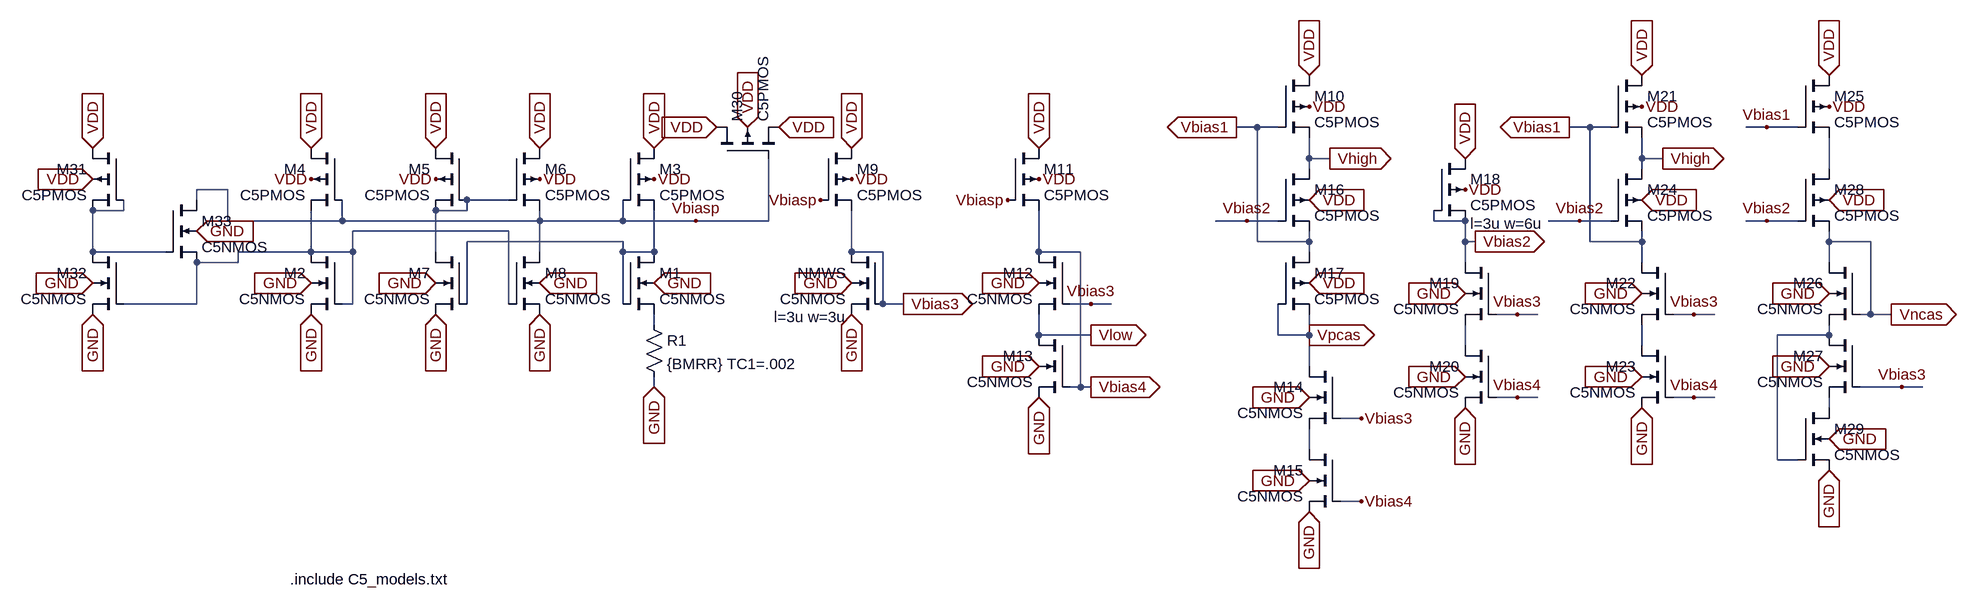
[diagram p0: schematic BMRCASC.asc]
BMRCASC.asc, the LTspice schematic file:
Version 4
SHEET 1 2832 776
WIRE 1680 -80 1648 -80
WIRE 1712 -80 1680 -80
WIRE 2192 -80 2160 -80
WIRE 2224 -80 2192 -80
WIRE 2464 -80 2432 -80
WIRE 2512 -80 2464 -80
WIRE 1760 -32 1760 -64
WIRE 1792 -32 1760 -32
WIRE 2272 -32 2272 -64
WIRE 2304 -32 2272 -32
WIRE 1760 -16 1760 -32
WIRE 2272 -16 2272 -32
WIRE 2560 -16 2560 -64
WIRE 96 16 48 16
WIRE 48 32 48 16
WIRE 528 32 464 32
WIRE -64 48 -64 32
WIRE -64 48 -112 48
WIRE 464 48 464 32
WIRE 464 48 416 48
WIRE 96 64 96 16
WIRE 272 64 272 32
WIRE 272 64 96 64
WIRE 576 64 576 48
WIRE 576 64 272 64
WIRE 704 64 704 32
WIRE 704 64 576 64
WIRE 816 64 704 64
WIRE 928 64 928 -32
WIRE 928 64 816 64
WIRE 1664 64 1616 64
WIRE 1712 64 1664 64
WIRE 1952 64 1952 48
WIRE 2000 64 1952 64
WIRE 2176 64 2128 64
WIRE 2224 64 2176 64
WIRE 2464 64 2432 64
WIRE 2512 64 2464 64
WIRE 528 80 288 80
WIRE 704 96 464 96
WIRE 1680 96 1680 -80
WIRE 1760 96 1760 80
WIRE 1760 96 1680 96
WIRE 2000 96 2000 64
WIRE 2016 96 2000 96
WIRE 2192 96 2192 -80
WIRE 2272 96 2272 80
WIRE 2272 96 2192 96
WIRE 2560 96 2560 80
WIRE 2624 96 2560 96
WIRE -112 112 -112 48
WIRE 0 112 -112 112
WIRE 224 112 224 48
WIRE 224 112 112 112
WIRE 288 112 288 80
WIRE 288 112 224 112
WIRE 416 112 416 48
WIRE 576 112 576 64
WIRE 704 112 704 96
WIRE 752 112 752 48
WIRE 752 112 704 112
WIRE 1056 112 1056 48
WIRE 1104 112 1056 112
WIRE 1344 112 1344 48
WIRE 1408 112 1344 112
WIRE 1760 112 1760 96
WIRE 112 128 112 112
WIRE 112 128 48 128
WIRE 2000 128 2000 96
WIRE 2272 128 2272 96
WIRE 2560 128 2560 96
WIRE 48 192 48 128
WIRE 48 192 -64 192
WIRE 288 192 288 112
WIRE 288 192 272 192
WIRE 464 192 464 96
WIRE 528 192 528 80
WIRE 704 192 704 112
WIRE 1104 192 1104 112
WIRE 1136 192 1104 192
WIRE 1424 192 1392 192
WIRE 1456 192 1424 192
WIRE 2080 208 2048 208
WIRE 2112 208 2080 208
WIRE 2352 208 2320 208
WIRE 2384 208 2352 208
WIRE 2624 208 2624 96
WIRE 2624 208 2608 208
WIRE 2656 208 2624 208
WIRE 752 224 752 208
WIRE 1344 240 1344 208
WIRE 1424 240 1344 240
WIRE 1712 240 1712 192
WIRE 1760 240 1760 208
WIRE 1760 240 1712 240
WIRE 2560 240 2560 224
WIRE 2560 240 2480 240
WIRE 2000 256 2000 224
WIRE 2272 256 2272 224
WIRE 2560 256 2560 240
WIRE 1760 288 1760 240
WIRE 752 320 752 304
WIRE 1408 320 1408 112
WIRE 1408 320 1392 320
WIRE 1424 320 1408 320
WIRE 2672 320 2608 320
WIRE 2704 320 2672 320
WIRE 2080 336 2048 336
WIRE 2112 336 2080 336
WIRE 2352 336 2320 336
WIRE 2384 336 2352 336
WIRE 2560 352 2560 336
WIRE 1840 368 1808 368
WIRE 1760 416 1760 384
WIRE 2480 432 2480 240
WIRE 2512 432 2480 432
WIRE 1840 496 1808 496
FLAG 224 -48 VDD
IOPIN 224 -48 In
FLAG 752 -48 VDD
IOPIN 752 -48 In
FLAG 752 0 VDD
FLAG 224 0 VDD
FLAG 416 0 VDD
FLAG 416 -48 VDD
IOPIN 416 -48 In
FLAG 576 -48 VDD
IOPIN 576 -48 In
FLAG 576 0 VDD
FLAG 816 64 Vbiasp
FLAG 1008 32 Vbiasp
FLAG 1056 0 VDD
FLAG 1056 -48 VDD
IOPIN 1056 -48 In
FLAG 1136 192 Vbias3
IOPIN 1136 192 Out
FLAG 1296 32 Vbiasp
FLAG 1344 0 VDD
FLAG 1344 -48 VDD
IOPIN 1344 -48 In
FLAG 1424 192 Vbias3
FLAG 1424 320 Vbias4
IOPIN 1424 320 Out
FLAG 1424 240 Vlow
IOPIN 1424 240 Out
FLAG 2000 16 VDD
FLAG 2000 -32 VDD
IOPIN 2000 -32 In
FLAG 2080 208 Vbias3
FLAG 2080 336 Vbias4
FLAG 2016 96 Vbias2
IOPIN 2016 96 Out
FLAG 2272 -112 VDD
FLAG 2272 -160 VDD
IOPIN 2272 -160 In
FLAG 2352 208 Vbias3
FLAG 2352 336 Vbias4
FLAG 2176 64 Vbias2
FLAG 2304 -32 Vhigh
IOPIN 2304 -32 Out
FLAG 2560 -112 VDD
FLAG 2560 -160 VDD
IOPIN 2560 -160 In
FLAG 2160 -80 Vbias1
IOPIN 2160 -80 Out
FLAG 2464 -80 Vbias1
FLAG 2464 64 Vbias2
FLAG 2656 208 Vncas
IOPIN 2656 208 Out
FLAG 2672 320 Vbias3
FLAG 224 160 GND
IOPIN 224 160 In
FLAG 224 208 GND
IOPIN 224 208 In
FLAG 416 208 GND
IOPIN 416 208 In
FLAG 416 160 GND
IOPIN 416 160 In
FLAG 576 208 GND
IOPIN 576 208 In
FLAG 576 160 GND
IOPIN 576 160 In
FLAG 752 160 GND
IOPIN 752 160 In
FLAG 752 320 GND
IOPIN 752 320 In
FLAG 1056 208 GND
IOPIN 1056 208 In
FLAG 1056 160 GND
IOPIN 1056 160 In
FLAG 1344 336 GND
IOPIN 1344 336 In
FLAG 1344 288 GND
IOPIN 1344 288 In
FLAG 2000 352 GND
IOPIN 2000 352 In
FLAG 2000 304 GND
IOPIN 2000 304 In
FLAG 2272 352 GND
IOPIN 2272 352 In
FLAG 2272 304 GND
IOPIN 2272 304 In
FLAG 2560 448 GND
IOPIN 2560 448 In
FLAG 2560 400 GND
IOPIN 2560 400 In
FLAG 848 -80 VDD
IOPIN 848 -80 In
FLAG 944 -80 VDD
IOPIN 944 -80 In
FLAG 896 -80 VDD
IOPIN 896 -80 In
FLAG -112 -48 VDD
IOPIN -112 -48 In
FLAG -112 208 GND
IOPIN -112 208 In
FLAG -112 160 GND
IOPIN -112 160 In
FLAG -112 0 VDD
IOPIN -112 0 In
FLAG 1344 160 GND
IOPIN 1344 160 In
FLAG 2000 176 GND
IOPIN 2000 176 In
FLAG 2272 32 VDD
IOPIN 2272 32 In
FLAG 2272 176 GND
IOPIN 2272 176 In
FLAG 2560 288 GND
IOPIN 2560 288 In
FLAG 2560 176 GND
IOPIN 2560 176 In
FLAG 2560 32 VDD
IOPIN 2560 32 In
FLAG 48 80 GND
IOPIN 48 80 In
FLAG 1760 -112 VDD
FLAG 1760 -160 VDD
IOPIN 1760 -160 In
FLAG 1840 368 Vbias3
FLAG 1840 496 Vbias4
FLAG 1664 64 Vbias2
FLAG 1792 -32 Vhigh
IOPIN 1792 -32 Out
FLAG 1648 -80 Vbias1
IOPIN 1648 -80 Out
FLAG 1760 512 GND
IOPIN 1760 512 In
FLAG 1760 464 GND
IOPIN 1760 464 In
FLAG 1760 32 VDD
IOPIN 1760 32 In
FLAG 1760 336 GND
IOPIN 1760 336 In
FLAG 1760 160 VDD
IOPIN 1760 160 In
FLAG 1760 240 Vpcas
IOPIN 1760 240 Out
SYMBOL nmos4 272 112 M0
SYMATTR InstName M2
SYMATTR Value2 l={L} w={NW}
SYMATTR Value C5NMOS
SYMBOL nmos4 704 112 R0
SYMATTR InstName M1
SYMATTR Value2 l={L} w=60u
SYMATTR Value C5NMOS
SYMBOL pmos4 704 -48 R0
SYMATTR InstName M3
SYMATTR Value C5PMOS
SYMATTR Value2 l={L} w={PW}
SYMBOL pmos4 272 -48 M0
SYMATTR InstName M4
SYMATTR Value C5PMOS
SYMATTR Value2 l={L} w={PW}
SYMBOL res 736 208 R0
SYMATTR InstName R1
SYMATTR Value {BMRR} TC1=.002
SYMBOL pmos4 464 -48 M0
SYMATTR InstName M5
SYMATTR Value C5PMOS
SYMATTR Value2 l={L} w={PW}
SYMBOL pmos4 528 -48 R0
SYMATTR InstName M6
SYMATTR Value C5PMOS
SYMATTR Value2 l={L} w={PW}
SYMBOL nmos4 464 112 M0
SYMATTR InstName M7
SYMATTR Value2 l={L} w={NW}
SYMATTR Value C5NMOS
SYMBOL nmos4 528 112 R0
SYMATTR InstName M8
SYMATTR Value2 l={L} w={NW}
SYMATTR Value C5NMOS
SYMBOL pmos4 1008 -48 R0
SYMATTR InstName M9
SYMATTR Value C5PMOS
SYMATTR Value2 l={L} w={PW}
SYMBOL nmos4 1104 112 M0
WINDOW 123 56 100 Left 2
SYMATTR Value2 l=3u w=3u
SYMATTR InstName NMWS
SYMATTR Value C5NMOS
SYMBOL pmos4 1296 -48 R0
SYMATTR InstName M11
SYMATTR Value C5PMOS
SYMATTR Value2 l={L} w={PW}
SYMBOL nmos4 1392 112 M0
SYMATTR InstName M12
SYMATTR Value2 l={L} w={NW}
SYMATTR Value C5NMOS
SYMBOL nmos4 1392 240 M0
SYMATTR InstName M13
SYMATTR Value2 l={L} w={NW}
SYMATTR Value C5NMOS
SYMBOL pmos4 1952 -32 R0
WINDOW 123 56 100 Left 2
SYMATTR Value2 l=3u w=6u
SYMATTR InstName M18
SYMATTR Value C5PMOS
SYMBOL nmos4 2048 128 M0
SYMATTR InstName M19
SYMATTR Value2 l={L} w={NW}
SYMATTR Value C5NMOS
SYMBOL nmos4 2048 256 M0
SYMATTR InstName M20
SYMATTR Value2 l={L} w={NW}
SYMATTR Value C5NMOS
SYMBOL pmos4 2224 -160 R0
SYMATTR InstName M21
SYMATTR Value C5PMOS
SYMATTR Value2 l={L} w={PW}
SYMBOL nmos4 2320 128 M0
SYMATTR InstName M22
SYMATTR Value2 l={L} w={NW}
SYMATTR Value C5NMOS
SYMBOL nmos4 2320 256 M0
SYMATTR InstName M23
SYMATTR Value2 l={L} w={NW}
SYMATTR Value C5NMOS
SYMBOL pmos4 2224 -16 R0
SYMATTR InstName M24
SYMATTR Value C5PMOS
SYMATTR Value2 l={L} w={PW}
SYMBOL pmos4 2512 -160 R0
SYMATTR InstName M25
SYMATTR Value C5PMOS
SYMATTR Value2 l={L} w={PW}
SYMBOL pmos4 2512 -16 R0
SYMATTR InstName M28
SYMATTR Value C5PMOS
SYMATTR Value2 l={L} w={PW}
SYMBOL nmos4 2608 128 M0
SYMATTR InstName M26
SYMATTR Value2 l={L} w={NW}
SYMATTR Value C5NMOS
SYMBOL nmos4 2608 240 M0
SYMATTR InstName M27
SYMATTR Value2 l={L} w={NW}
SYMATTR Value C5NMOS
SYMBOL nmos4 2512 352 R0
SYMATTR InstName M29
SYMATTR Value2 l={L} w={NW}
SYMATTR Value C5NMOS
SYMBOL pmos4 848 -32 R270
SYMATTR InstName M30
SYMATTR Value C5PMOS
SYMATTR Value2 l=30u w=30u
SYMBOL pmos4 -64 -48 M0
SYMATTR InstName M31
SYMATTR Value C5PMOS
SYMATTR Value2 l=12u w=6u
SYMBOL nmos4 -64 112 M0
SYMATTR InstName M32
SYMATTR Value2 l={L} w={NW}
SYMATTR Value C5NMOS
SYMBOL nmos4 0 32 R0
SYMATTR InstName M33
SYMATTR Value2 l=600n w=6u
SYMATTR Value C5NMOS
SYMBOL pmos4 1712 -160 R0
SYMATTR InstName M10
SYMATTR Value C5PMOS
SYMATTR Value2 l={L} w={PW}
SYMBOL nmos4 1808 288 M0
SYMATTR InstName M14
SYMATTR Value2 l={L} w={NW}
SYMATTR Value C5NMOS
SYMBOL nmos4 1808 416 M0
SYMATTR InstName M15
SYMATTR Value2 l={L} w={NW}
SYMATTR Value C5NMOS
SYMBOL pmos4 1712 -16 R0
SYMATTR InstName M16
SYMATTR Value C5PMOS
SYMATTR Value2 l={L} w={PW}
SYMBOL pmos4 1712 112 R0
SYMATTR InstName M17
SYMATTR Value C5PMOS
SYMATTR Value2 l={L} w={PW}
TEXT 192 616 Left 2 !.include C5_models.txt

The netlist it stands for:
* BMRCASC.asc
M2 N004 N004 GND GND C5NMOS l={L} w={NW}
M1 N005 N005 N006 GND C5NMOS l={L} w=60u
M3 VDD Vbiasp N005 VDD C5PMOS l={L} w={PW}
M4 VDD Vbiasp N004 VDD C5PMOS l={L} w={PW}
R1 N006 GND {BMRR} TC1=.002
M5 VDD N002 N002 VDD C5PMOS l={L} w={PW}
M6 VDD N002 Vbiasp VDD C5PMOS l={L} w={PW}
M7 N002 N005 GND GND C5NMOS l={L} w={NW}
M8 Vbiasp N004 GND GND C5NMOS l={L} w={NW}
M9 VDD Vbiasp Vbias3 VDD C5PMOS l={L} w={PW}
M§NMWS Vbias3 Vbias3 GND GND C5NMOS l=3u w=3u
M11 VDD Vbiasp Vbias4 VDD C5PMOS l={L} w={PW}
M12 Vbias4 Vbias3 Vlow GND C5NMOS l={L} w={NW}
M13 Vlow Vbias4 GND GND C5NMOS l={L} w={NW}
M18 VDD Vbias2 Vbias2 VDD C5PMOS l=3u w=6u
M19 Vbias2 Vbias3 N008 GND C5NMOS l={L} w={NW}
M20 N008 Vbias4 GND GND C5NMOS l={L} w={NW}
M21 VDD Vbias1 Vhigh VDD C5PMOS l={L} w={PW}
M22 Vbias1 Vbias3 N009 GND C5NMOS l={L} w={NW}
M23 N009 Vbias4 GND GND C5NMOS l={L} w={NW}
M24 Vhigh Vbias2 Vbias1 VDD C5PMOS l={L} w={PW}
M25 VDD Vbias1 N001 VDD C5PMOS l={L} w={PW}
M28 N001 Vbias2 Vncas VDD C5PMOS l={L} w={PW}
M26 Vncas Vncas N007 GND C5NMOS l={L} w={NW}
M27 N007 Vbias3 N010 GND C5NMOS l={L} w={NW}
M29 N010 N007 GND GND C5NMOS l={L} w={NW}
M30 VDD Vbiasp VDD VDD C5PMOS l=30u w=30u
M31 VDD N003 N003 VDD C5PMOS l=12u w=6u
M32 N003 N004 GND GND C5NMOS l={L} w={NW}
M33 Vbiasp N003 N004 GND C5NMOS l=600n w=6u
M10 VDD Vbias1 Vhigh VDD C5PMOS l={L} w={PW}
M14 Vpcas Vbias3 N011 GND C5NMOS l={L} w={NW}
M15 N011 Vbias4 GND GND C5NMOS l={L} w={NW}
M16 Vhigh Vbias2 Vbias1 VDD C5PMOS l={L} w={PW}
M17 Vbias1 Vpcas Vpcas VDD C5PMOS l={L} w={PW}
.model NMOS NMOS
.model PMOS PMOS
.lib standard.mos
.include C5_models.txt
.backanno
.end